# EasyEDA schematic appledore.json
TITLE: APPLEDORE - C64 keyboard to Apple-1; REV: 1.0; Date: 2022-10-24; Sheet: 1/1; Drawn By: CP; Company: P-LAB
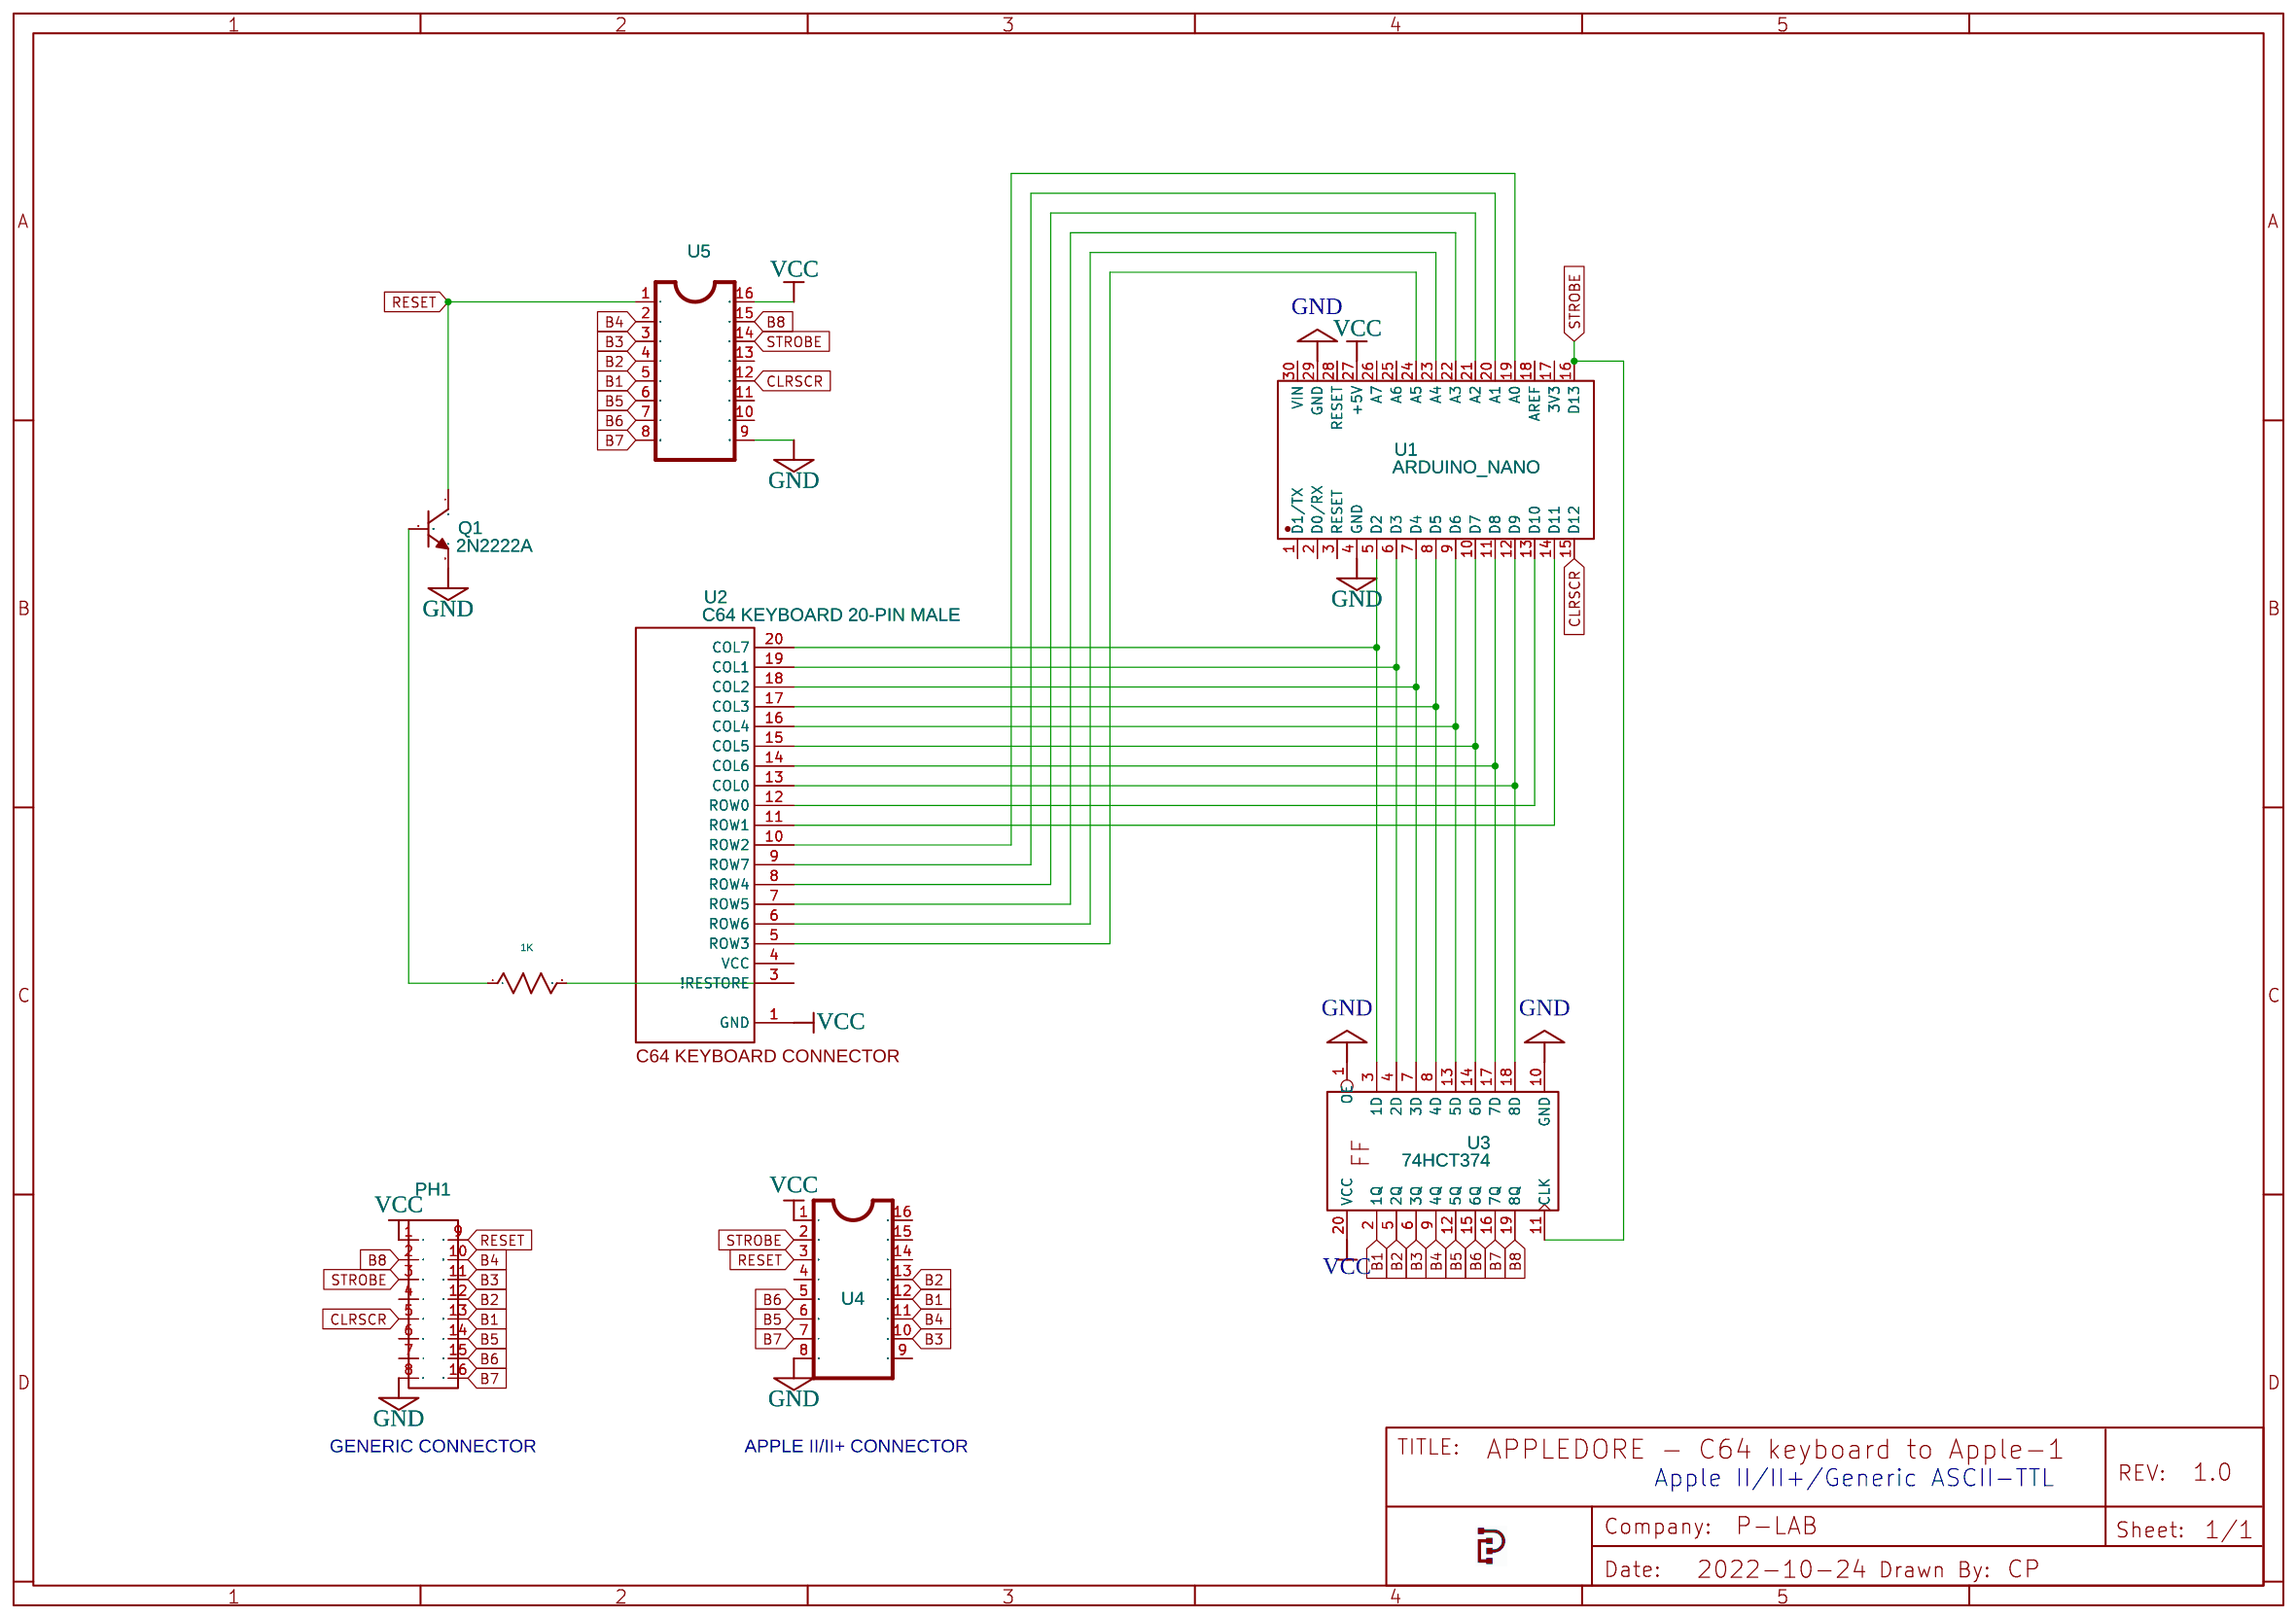
[diagram p0: schematic sheet]

## Parts
1K  1/4W RESISTOR  [AXIAL-6.5X2.3(1/4W)]
PH1  pinheader08x2  [PINHEADER_08X2]
Q1  2N2222A  [TO-92-3_L4.8-W3.7-P2.54-R]
U1  ARDUINO_NANO  [COMM-TH_ARDUINO_NANO]
U2  C64 KEYBOARD 20-PIN MALE  [C64 KEYBOARD CONNECTOR]
U3  74HCT374  [DIP20]
U4  IC_DIL16-DIP16  [DIP16]
U5  IC_DIL16-DIP16  [DIP16]

## Library data of the parts
1K = 1/4W RESISTOR: Contributor: NashvilleAmps
PH1 = pinheader08x2: Manufacturer Part: Header 6x1; Contributor: s1atbewie.de
Q1 = 2N2222A: Supplier: LCSC; Supplier Part: C358533; Manufacturer: BLUE ROCKET(蓝箭); Contributor: LCSC; JLCPCB Part Class: Extended Part; Package Display: No
U1 = ARDUINO_NANO: Supplier: LCSC; Supplier Part: C9900017879; Manufacturer: null; JLCPCB Part Class: Extended Part; Contributor: lcsc; Package Display: No
U2 = C64 KEYBOARD 20-PIN MALE: Contributor: TomPilot; Package Display: Yes
U3 = 74HCT374: Package Display: No
U4 U5 = IC_DIL16-DIP16: Universal 16 pins IC; Contributor: DangerousPrototype

## Nets
GND: PH1.8 Q1.3(E) U1.4(GND) U1.29(GND) U3.1(OE) U3.10(GND) U4.8 U5.9
VCC: PH1.1 U1.27(+5V) U2.1(GND) U3.20(VCC) U4.1 U5.16
B1: PH1.13 U3.2(1Q) U4.12 U5.5
B2: PH1.12 U3.5(2Q) U4.13 U5.4
B3: PH1.11 U3.6(3Q) U4.10 U5.3
B4: PH1.10 U3.9(4Q) U4.11 U5.2
B5: PH1.14 U3.12(5Q) U4.6 U5.6
B6: PH1.15 U3.15(6Q) U4.5 U5.7
B7: PH1.16 U3.16(7Q) U4.7 U5.8
B8: PH1.2 U3.19(8Q) U5.15
CLRSCR: PH1.5 U1.15(D12) U5.12
RESET: PH1.9 Q1.1(C) U4.3 U5.1
STROBE: PH1.3 U1.16(D13) U3.11(CLK) U4.2 U5.14
Net-(1K-1): 1K.1 Q1.2(B)
Net-(1K-2): 1K.2 U2.3(!RESTORE)
Net-(U1-5): U1.5(D2) U2.20(COL7) U3.3(1D)
Net-(U1-6): U1.6(D3) U2.19(COL1) U3.4(2D)
Net-(U1-7): U1.7(D4) U2.18(COL2) U3.7(3D)
Net-(U1-8): U1.8(D5) U2.17(COL3) U3.8(4D)
Net-(U1-9): U1.9(D6) U2.16(COL4) U3.13(5D)
Net-(U1-10): U1.10(D7) U2.15(COL5) U3.14(6D)
Net-(U1-11): U1.11(D8) U2.14(COL6) U3.17(7D)
Net-(U1-12): U1.12(D9) U2.13(COL0) U3.18(8D)
Net-(U1-13): U1.13(D10) U2.12(ROW0)
Net-(U1-14): U1.14(D11) U2.11(ROW1)
Net-(U1-19): U1.19(A0) U2.10(ROW2)
Net-(U1-20): U1.20(A1) U2.9(ROW7)
Net-(U1-21): U1.21(A2) U2.8(ROW4)
Net-(U1-22): U1.22(A3) U2.7(ROW5)
Net-(U1-23): U1.23(A4) U2.6(ROW6)
Net-(U1-24): U1.24(A5) U2.5(ROW3)

Not connected (* = marked no-connect by the designer): PH1 4 6 7; U1 1(D1/TX) 2(D0/RX) 3(RESET) 17(3V3) 18(AREF) 25(A6) 26(A7) 28(RESET) 30(VIN); U2 4(VCC); U4 4 9 14 15 16; U5 10 11 13

## Notes on the sheet
- GENERIC CONNECTOR
- APPLE II/II+ CONNECTOR
- Apple II/II+/Generic ASCII-TTL
